# EAGLE schematic asset-tracker-v008 (EAGLE 8.3.2)
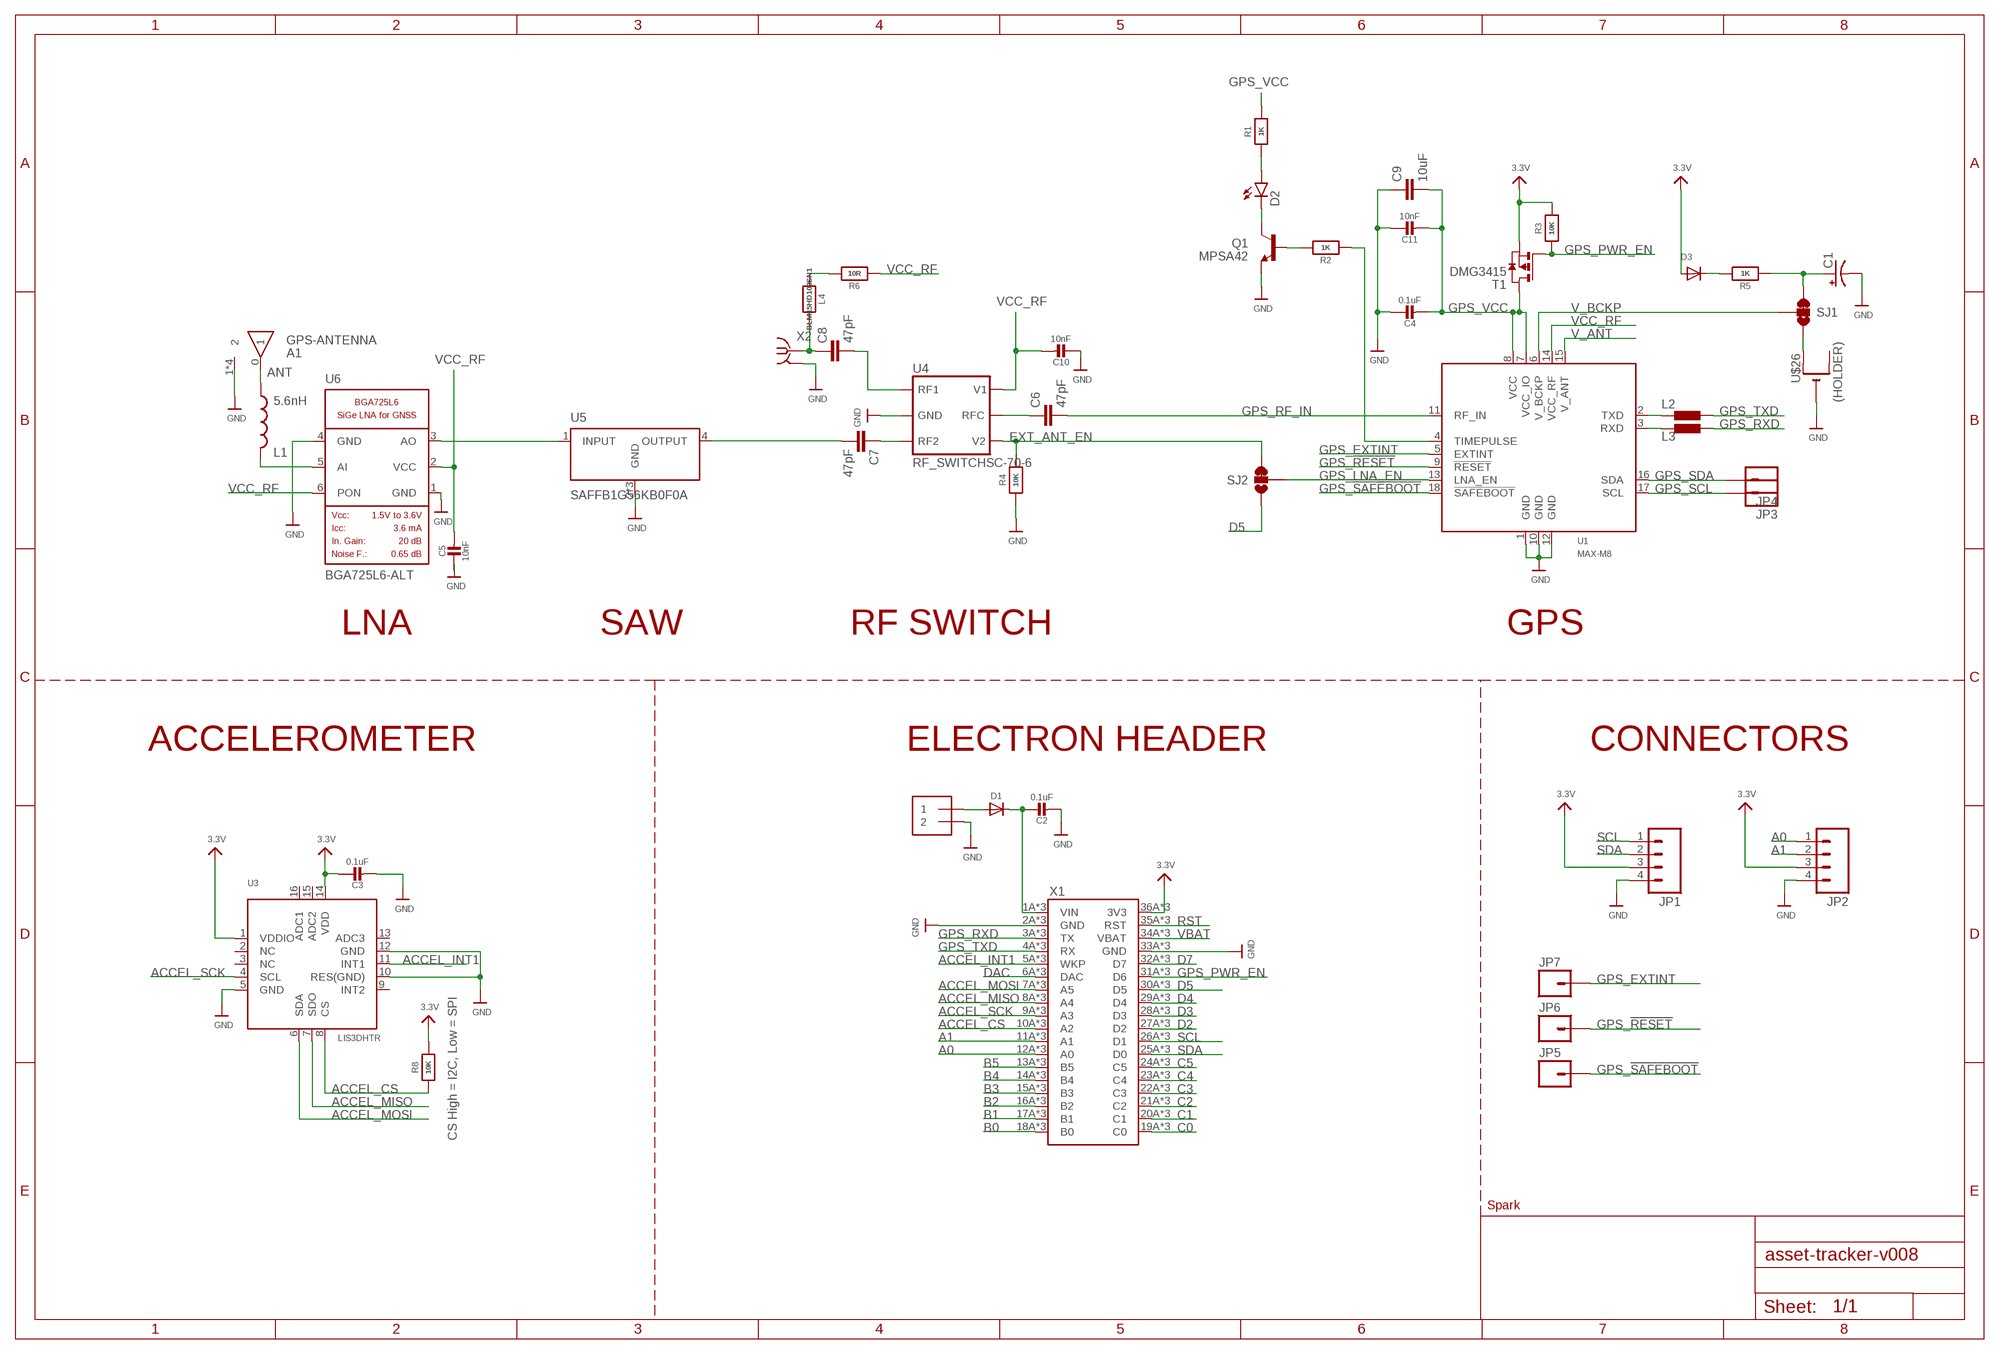
[diagram p0: schematic, sheet 1]

## Parts
A1  GPS-ANTENNA  [ANT1818B00BT1516S]
C1  SUPERCAP  [414-VA5R]
C2  0.1uF  CAP_CERAMIC_0402MP  [_0402MP]
C3  0.1uF  CAP_CERAMIC_0402MP  [_0402MP]
C4  0.1uF  CAP_CERAMIC_0402MP  [_0402MP]
C5  10nF  CAP_CERAMIC_0402MP  [_0402MP]
C6  47pF  C-EUC0201  [C0201]
C7  47pF  C-EUC0201  [C0201]
C8  47pF  C-EUC0201  [C0201]
C9  10uF  C-EUC0402  [C0402]
C10  10nF  CAP_CERAMIC_0402MP  [_0402MP]
C11  10nF  CAP_CERAMIC_0402MP  [_0402MP]
D1  DIODESMA  [SMADIODE]
D2  LED0603  [LED-0603]
D3  DIODESOD-523  [SOD-523]
J1  1X2-3.5MM  [1X2-3.5MM]
JP1  M04GROVE  [CONNCTOR_GROVE]
JP2  M04GROVE  [CONNCTOR_GROVE]
JP3  M01SMD-4.5X1.5  [PAD-1.5X4.5]
JP4  M01SMD-4.5X1.5  [PAD-1.5X4.5]
JP5  M01SMD-4.5X1.5  [PAD-1.5X4.5]
JP6  M01SMD-4.5X1.5  [PAD-1.5X4.5]
JP7  M01SMD-4.5X1.5  [PAD-1.5X4.5]
L1  5.6nH  INDUCTOR0402  [C0402]
L2  BLM15H2  [_0402MP]
L3  BLM15H2  [_0402MP]
L4  BLM15HD102SN1  RESISTOR_0402MP  [_0402MP]
Q1  MPSA42  TRANSISTOR_NPNMPSA42  [SOT23-3]
R1  1K  RESISTOR_0402MP  [_0402MP]
R2  1K  RESISTOR_0402MP  [_0402MP]
R3  10K  RESISTOR_0402MP  [_0402MP]
R4  10K  RESISTOR_0402MP  [_0402MP]
R5  1K  RESISTOR_0402MP  [_0402MP]
R6  10R  RESISTOR_0402MP  [_0402MP]
R8  10K  RESISTOR_0402MP  [_0402MP]
SJ1  JUMPER-PAD-3-2OF3_NC_BY_TRACE_LARGE  [PAD-JUMPER-3-2OF3_NC_BY_TRACE_YES_SILK_LARGE]
SJ2  JUMPER-PAD-3-2OF3_NC_BY_TRACE_LARGE  [PAD-JUMPER-3-2OF3_NC_BY_TRACE_YES_SILK_LARGE]
T1  DMG3415  PMOSSOT23  [SOT-23]
U1  MAX-M8  [MAX-M8]
U3  LIS3DHTR  ACCEL_LIS3DHTR  [LGA16_3X3MM]
U4  RF_SWITCHSC-70-6  [SC70-6]
U5  SAFFB1G56KB0F0A  FILTERS  [QCS5I]
U6  BGA725L6-ALT  [LNA-TSLP-6-2-ALT]
U$26  CR2032SMT  [CR2032-SMD]
U$31  SPARK_LOGO  [SPARK_LOGO_TSTOP]
X1  ELECTRON  ELECTRON_SMT  [ELECTRON_SMT]
X2  IPEX-20279-001E  [IPEX-20279-001E]

## Nets
3.3V: C3.1 D3.A JP1.3 JP2.3 R3.2 R8.2 T1.2(S) U3.1(VDDIO) U3.14(VDD) X1.36A(3V3) X1.36B(3V3) X1.36C(3V3)
A0: JP2.1 X1.12A(A0) X1.12B(A0) X1.12C(A0)
A1: JP2.2 X1.11A(A1) X1.11B(A1) X1.11C(A1)
ACCEL_CS: R8.1 U3.8(CS) X1.10A(A2) X1.10B(A2) X1.10C(A2)
ACCEL_INT1: U3.11(INT1) X1.5A(WKP) X1.5B(WKP) X1.5C(WKP)
ACCEL_MISO: U3.7(SDO) X1.8A(A4) X1.8B(A4) X1.8C(A4)
ACCEL_MOSI: U3.6(SDA) X1.7A(A5) X1.7B(A5) X1.7C(A5)
ACCEL_SCK: U3.4(SCL) X1.9A(A3) X1.9B(A3) X1.9C(A3)
ANT: A1.0 L1.2
B0: X1.18A(B0) X1.18B(B0) X1.18C(B0)
B1: X1.17A(B1) X1.17B(B1) X1.17C(B1)
B2: X1.16A(B2) X1.16B(B2) X1.16C(B2)
B3: X1.15A(B3) X1.15B(B3) X1.15C(B3)
B4: X1.14A(B4) X1.14B(B4) X1.14C(B4)
B5: X1.13A(B5) X1.13B(B5) X1.13C(B5)
C0: X1.19A(C0) X1.19B(C0) X1.19C(C0)
C1: X1.20A(C1) X1.20B(C1) X1.20C(C1)
C2: X1.21A(C2) X1.21B(C2) X1.21C(C2)
C3: X1.22A(C3) X1.22B(C3) X1.22C(C3)
C4: X1.23A(C4) X1.23B(C4) X1.23C(C4)
C5: X1.24A(C5) X1.24B(C5) X1.24C(C5)
D2: X1.27A(D2) X1.27B(D2) X1.27C(D2)
D3: X1.28A(D3) X1.28B(D3) X1.28C(D3)
D4: X1.29A(D4) X1.29B(D4) X1.29C(D4)
D5: SJ2.1 X1.30A(D5) X1.30B(D5) X1.30C(D5)
D7: X1.32A(D7) X1.32B(D7) X1.32C(D7)
DAC: X1.6A(DAC) X1.6B(DAC) X1.6C(DAC)
EXT_ANT: C8.1 L4.2 X2.1
EXT_ANT_EN: R4.2 SJ2.3 U4.4(V2)
GND: A1.1 A1.2 A1.3 A1.4 C1.- C2.2 C3.2 C4.1 C5.1 C9.1 C10.1 C11.1 J1.2 JP1.4 JP2.4 Q1.2(E) R4.1 U1.1(GND) U1.10(GND) U1.12(GND) U3.5(GND) U3.10(RES(GND)) U3.12(GND) U4.2(GND) U5.2(GND) U5.3(GND) U5.5(GND) U6.1(GND) U6.4(GND) U$26.- X1.2A(GND) X1.2B(GND) X1.2C(GND) X1.33A(GND) X1.33B(GND) X1.33C(GND) X2.2@1(GND) X2.2@2(GND)
GPS_!RESET: JP6.P$1 U1.9(!RESET)
GPS_!SAFEBOOT: JP5.P$1 U1.18(!SAFEBOOT)
GPS_EXTINT: JP7.P$1 U1.5(EXTINT)
GPS_LNA_EN: SJ2.2 U1.13(LNA_EN)
GPS_PWR_EN: R3.1 T1.3(G) X1.31A(D6) X1.31B(D6) X1.31C(D6)
GPS_RF_IN: C6.2 U1.11(RF_IN)
GPS_RXD: L3.2 X1.3A(TX) X1.3B(TX) X1.3C(TX)
GPS_SCL: JP3.P$1 U1.17(SCL)
GPS_SDA: JP4.P$1 U1.16(SDA)
GPS_TXD: L2.2 X1.4A(RX) X1.4B(RX) X1.4C(RX)
GPS_VCC: C4.2 C9.2 C11.2 R1.2 T1.1(D) U1.7(VCC_IO) U1.8(VCC)
LNA_IN: L1.1 U6.5(AI)
LNA_OUT: U5.1(INPUT) U6.3(AO)
N$1: L4.1 R6.2
N$7: C1.+ R5.1 SJ1.3
N$8: C2.1 D1.C X1.1A(VIN) X1.1B(VIN) X1.1C(VIN)
N$9: D1.A J1.1
N$10: D3.K(C) R5.2
N$11: SJ1.1 U$26.+$1(+)
N$37: Q1.1(B) R2.2
N$38: D2.C Q1.3(C)
N$39: D2.A R1.1
N$40: L2.1 U1.2(TXD)
N$41: L3.1 U1.3(RXD)
RF1: C8.2 U4.1(RF1)
RF2: C7.1 U4.3(RF2)
RF_SWITCH_OUT: C6.1 U4.5(RFC)
RST: X1.35A(RST) X1.35B(RST) X1.35C(RST)
SAW_OUT: C7.2 U5.4(OUTPUT)
SCL: JP1.1 X1.26A(D1) X1.26B(D1) X1.26C(D1)
SDA: JP1.2 X1.25A(D0) X1.25B(D0) X1.25C(D0)
TIMEPULSE: R2.1 U1.4(TIMEPULSE)
V_ANT: U1.15(V_ANT)
V_BCKP: SJ1.2 U1.6(V_BCKP)
VBAT: X1.34A(VBAT) X1.34B(VBAT) X1.34C(VBAT)
VCC_RF: C5.2 C10.2 R6.1 U1.14(VCC_RF) U4.6(V1) U6.2(VCC) U6.6(PON)
Unconnected: U3.2(NC) U3.3(NC) U3.9(INT2) U3.13(ADC3) U3.15(ADC2) U3.16(ADC1) U$26.+$2(+1)

## Notes on the sheet
- (HOLDER)
- LNA | SAW | RF SWITCH | GPS
- ACCELEROMETER | ELECTRON HEADER | CONNECTORS
- CS High = I2C, Low = SPI

## Library data of the parts
A1 = antenna:GPS-ANTENNA
C1 = adafruit:SUPERCAP
C2 C3 = microbuilder:CAP_CERAMIC: Ceramic Capacitors For new designs, use the packages preceded by an '_' character since they are more reliable: The following footprints should be used on most boards: _0402 - Standard footprint for regular board layouts _0603 - Standard footprint for regular board layouts _0805 - Standard footprint for regular board layouts _1206 - Standard footprint for regular board layouts For extremely tight-pitch boards where space is at a premium, the following 'micro-pitch' footprints can be used (smaller pads, no silkscreen outline, etc.): _0402MP - Micro-pitch footprint for very dense/compact boards _0603MP - Micro-pitch footprint for very dense/compact boards _0805MP - Micro-pitch footprint for very dense/compact boards _1206MP - Micro-pitch footprint for very dense/compact boards
C4 C5 C10 C11 = asset-tracker-v008:CAP_CERAMIC: Ceramic Capacitors For new designs, use the packages preceded by an '_' character since they are more reliable: The following footprints should be used on most boards: _0402 - Standard footprint for regular board layouts _0603 - Standard footprint for regular board layouts _0805 - Standard footprint for regular board layouts _1206 - Standard footprint for regular board layouts For extremely tight-pitch boards where space is at a premium, the following 'micro-pitch' footprints can be used (smaller pads, no silkscreen outline, etc.): _0402MP - Micro-pitch footprint for very dense/compact boards _0603MP - Micro-pitch footprint for very dense/compact boards _0805MP - Micro-pitch footprint for very dense/compact boards _1206MP - Micro-pitch footprint for very dense/compact boards
C6-C9 = rcl:C-EU: CAPACITOR, European symbol
D1 = microbuilder:DIODE: Diode
D2 = SparkFun-LED:LED: LEDs Standard schematic elements and footprints for 5mm, 3mm, 1206, and 0603 sized LEDs. 5mm - Spark Fun Electronics SKU : COM-00529 (and others)
D3 = adafruit:DIODE: Diode
J1 = adafruit2:1X2: 3.5mm Terminal block http://www.ladyada.net/library/pcb/eaglelibrary.html
JP1 JP2 = asset-tracker-v008:M04: Header 4 Standard 4-pin 0.1" header. Use with straight break away headers (SKU : PRT-00116), right angle break away headers (PRT-00553), swiss pins (PRT-00743), machine pins (PRT-00117), and female headers (PRT-00115). Molex polarized connector foot print use with SKU : PRT-08231 with associated crimp pins and housings. 1MM SMD Version SKU: PRT-10208
JP3-JP7 = SparkFun-Connectors:M01: Header 1 Standard 1-pin 0.1" header. Use with straight break away headers (SKU : PRT-00116), right angle break away headers (PRT-00553), swiss pins (PRT-00743), machine pins (PRT-00117), and female headers (PRT-00115). SMTSO-256-ET is a "flush mount" nut for a 4-40 screw. The older package used to be too tight, and did not allow it to sit properly thru the drill hit. The latest (0.165DIA) fits nice and snug.
L1 = SparkFun-Passives:INDUCTOR: Inductors Basic Inductor/Choke - 0603 and 1206. Footprints are not proven and vary greatly between part numbers. INDUCTOR POWER 3.3UH 4.0A SMD 0.197" L x 0.197" W x 0.177" H (5.00mm x 5.00mm x 4.50mm)
L2 L3 = asset-tracker-v008:BLM15H: EMIFIL (R) Chip Ferrite Bead for GHz Noise Source: http://www.murata.com/ Ferrite Bead BLM15H.pdf
L4 R6 R8 = microbuilder:RESISTOR: Resistors For new designs, use the packages preceded by an '_' character since they are more reliable: The following footprints should be used on most boards: _0402 - Standard footprint for regular board layouts _0603 - Standard footprint for regular board layouts _0805 - Standard footprint for regular board layouts _1206 - Standard footprint for regular board layouts For extremely tight-pitch boards where space is at a premium, the following 'micro-pitch' footprints can be used (smaller pads, no silkscreen outline, etc.): _0402MP - Micro-pitch footprint for very dense/compact boards _0603MP - Micro-pitch footprint for very dense/compact boards _0805MP - Micro-pitch footprint for very dense/compact boards _1206MP - Micro-pitch footprint for very dense/compact boards
Q1 = SparkFun-DiscreteSemi:TRANSISTOR_NPN: Generic NPN BJT MMBT2222A - TRANS-08049 (SOT-23, 1A 40V) MPSA42 - TRANS-09116 (SOT-23, 500mA 300V) MMBT5088LT1G - TRANS-11160 (SOT-23, 50 mA 30V) BC547 - COM-08928 <http://www.sparkfun.com/products/8928> (TO-92 45V 100mA) (1.Collector 2.Base 3.Emitter) 2N3904 - COM-00521 <http://www.sparkfun.com/products/521> (TO-92 40V 200mA) (1.Emitter 2.Base 3.Collector) P2N2222A - COM-12852 <http://www.sparkfun.com/products/12852> (TO-92 40V 600mA) (1.Collector 2.Base 3.Emitter); PROD_ID: TRANS-09116
R1-R5 = asset-tracker-v008:RESISTOR: Resistors For new designs, use the packages preceded by an '_' character since they are more reliable: The following footprints should be used on most boards: _0402 - Standard footprint for regular board layouts _0603 - Standard footprint for regular board layouts _0805 - Standard footprint for regular board layouts _1206 - Standard footprint for regular board layouts For extremely tight-pitch boards where space is at a premium, the following 'micro-pitch' footprints can be used (smaller pads, no silkscreen outline, etc.): _0402MP - Micro-pitch footprint for very dense/compact boards _0603MP - Micro-pitch footprint for very dense/compact boards _0805MP - Micro-pitch footprint for very dense/compact boards _1206MP - Micro-pitch footprint for very dense/compact boards
SJ1 SJ2 = SparkFun-Passives:JUMPER-PAD-3-2OF3_NC_BY_TRACE
T1 = zetex:PMOSSOT23: MOS FET; OC_FARNELL: unknown; OC_NEWARK: unknown
U1 = u-blox:MAX-M8
U3 = microbuilder:ACCEL_LIS3DHTR: LIS3DHTR 3-Axis Accelerometer with I2C/SPI Interface VDD: 1.71-3.6V VDDIO: 1.71-VDD+0.1V Scale: +/-2g, 4g, 8g, 16g with 16--bit data output Temp:: -40°C - 85°C Mouser: 511-LIS3DHTR Digikey: 497-10613-1-ND
U4 = Particle:RF_SWITCH: GaAs SPDT Switch DC - 3.0GHz+
U5 = Particle:FILTERS
U6 = Particle:BGA725L6
U$26 = adafruit:CR2032
U$31 = Spark:SPARK_LOGO
X1 = microbuilder:ELECTRON
X2 = Particle:IPEX-20279-001E: Ultra Miniature Coaxial SMT RF Receptacle